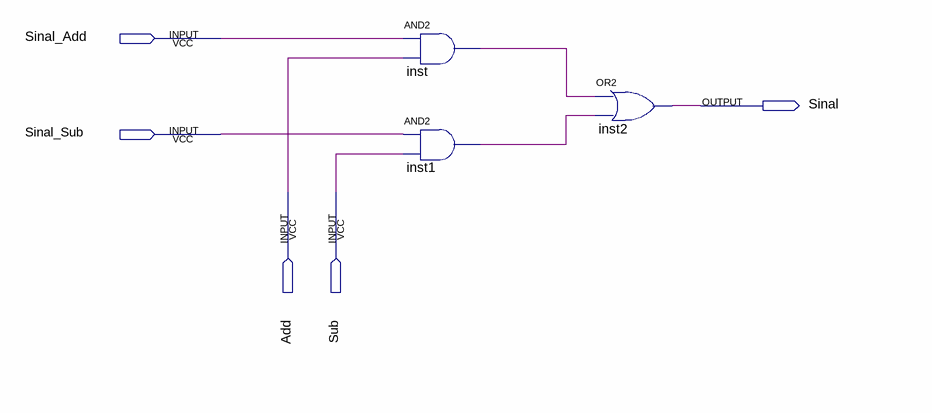
[diagram p0: schematic sheet]
// Quartus schematic MUX_2S_2E_1bit.bdf as structural Verilog: 3 symbols, 5 pins
module MUX_2S_2E_1bit (
  input  Sinal_Add,
  input  Sinal_Sub,
  input  Add,
  input  Sub,
  output Sinal
);

  wire inst1_out, inst_out;

  and inst (inst_out, Sinal_Add, Add);
  and inst1 (inst1_out, Sinal_Sub, Sub);
  or inst2 (Sinal, inst_out, inst1_out);
endmodule
